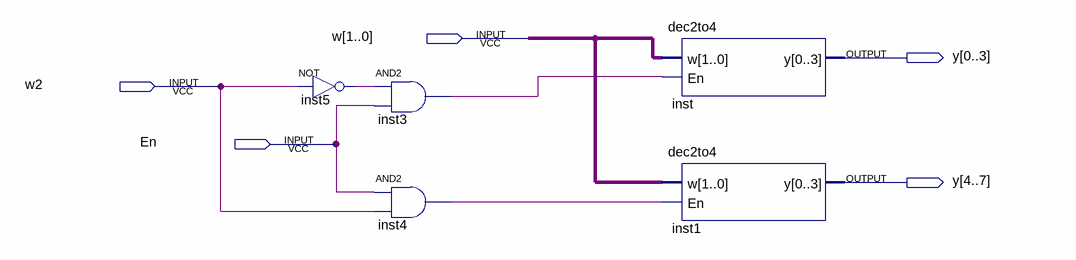
[diagram p0: schematic sheet]
// Quartus schematic 3to8decode.bdf as structural Verilog: 5 symbols, 5 pins
module \3to8decode  (
  input  [1:0] w,
  input  w2,
  input  En,
  output [0:7] y
);

  wire inst3_out, inst4_out, inst5_out;

  not inst5 (inst5_out, w2);
  and inst3 (inst3_out, inst5_out, En);
  and inst4 (inst4_out, En, w2);
  dec2to4 inst (.w(w), .En(inst3_out), .y(y[0:3]));
  dec2to4 inst1 (.w(w), .En(inst4_out), .y(y[4:7]));
endmodule
